# Altium schematic sheet Supply_Magneto.SchDoc: Power Supply
size 420 x 297 mm; EDA_Number: ARTIQ; Projet: HVPSU_ISOL; Author: G.Kasprowicz; CompanyName: WUT ISE; DrawnBy: G.Kasprowicz; Organization: WUT ISE; Address1: PW ISE; Address2: Nowowiejska 15/19 00-665 Warsaw; Address3: gkasprow@gmail.com; DocumentNumber: 4; Revision: 2; SheetNumber: 4; SheetTotal: 7; ModifiedBy: -; CheckedDate: -; DivGrp: WUT ISE; Designer: G.Kasprowicz; ModifiedDate: -; ProjectName: Sensor Box
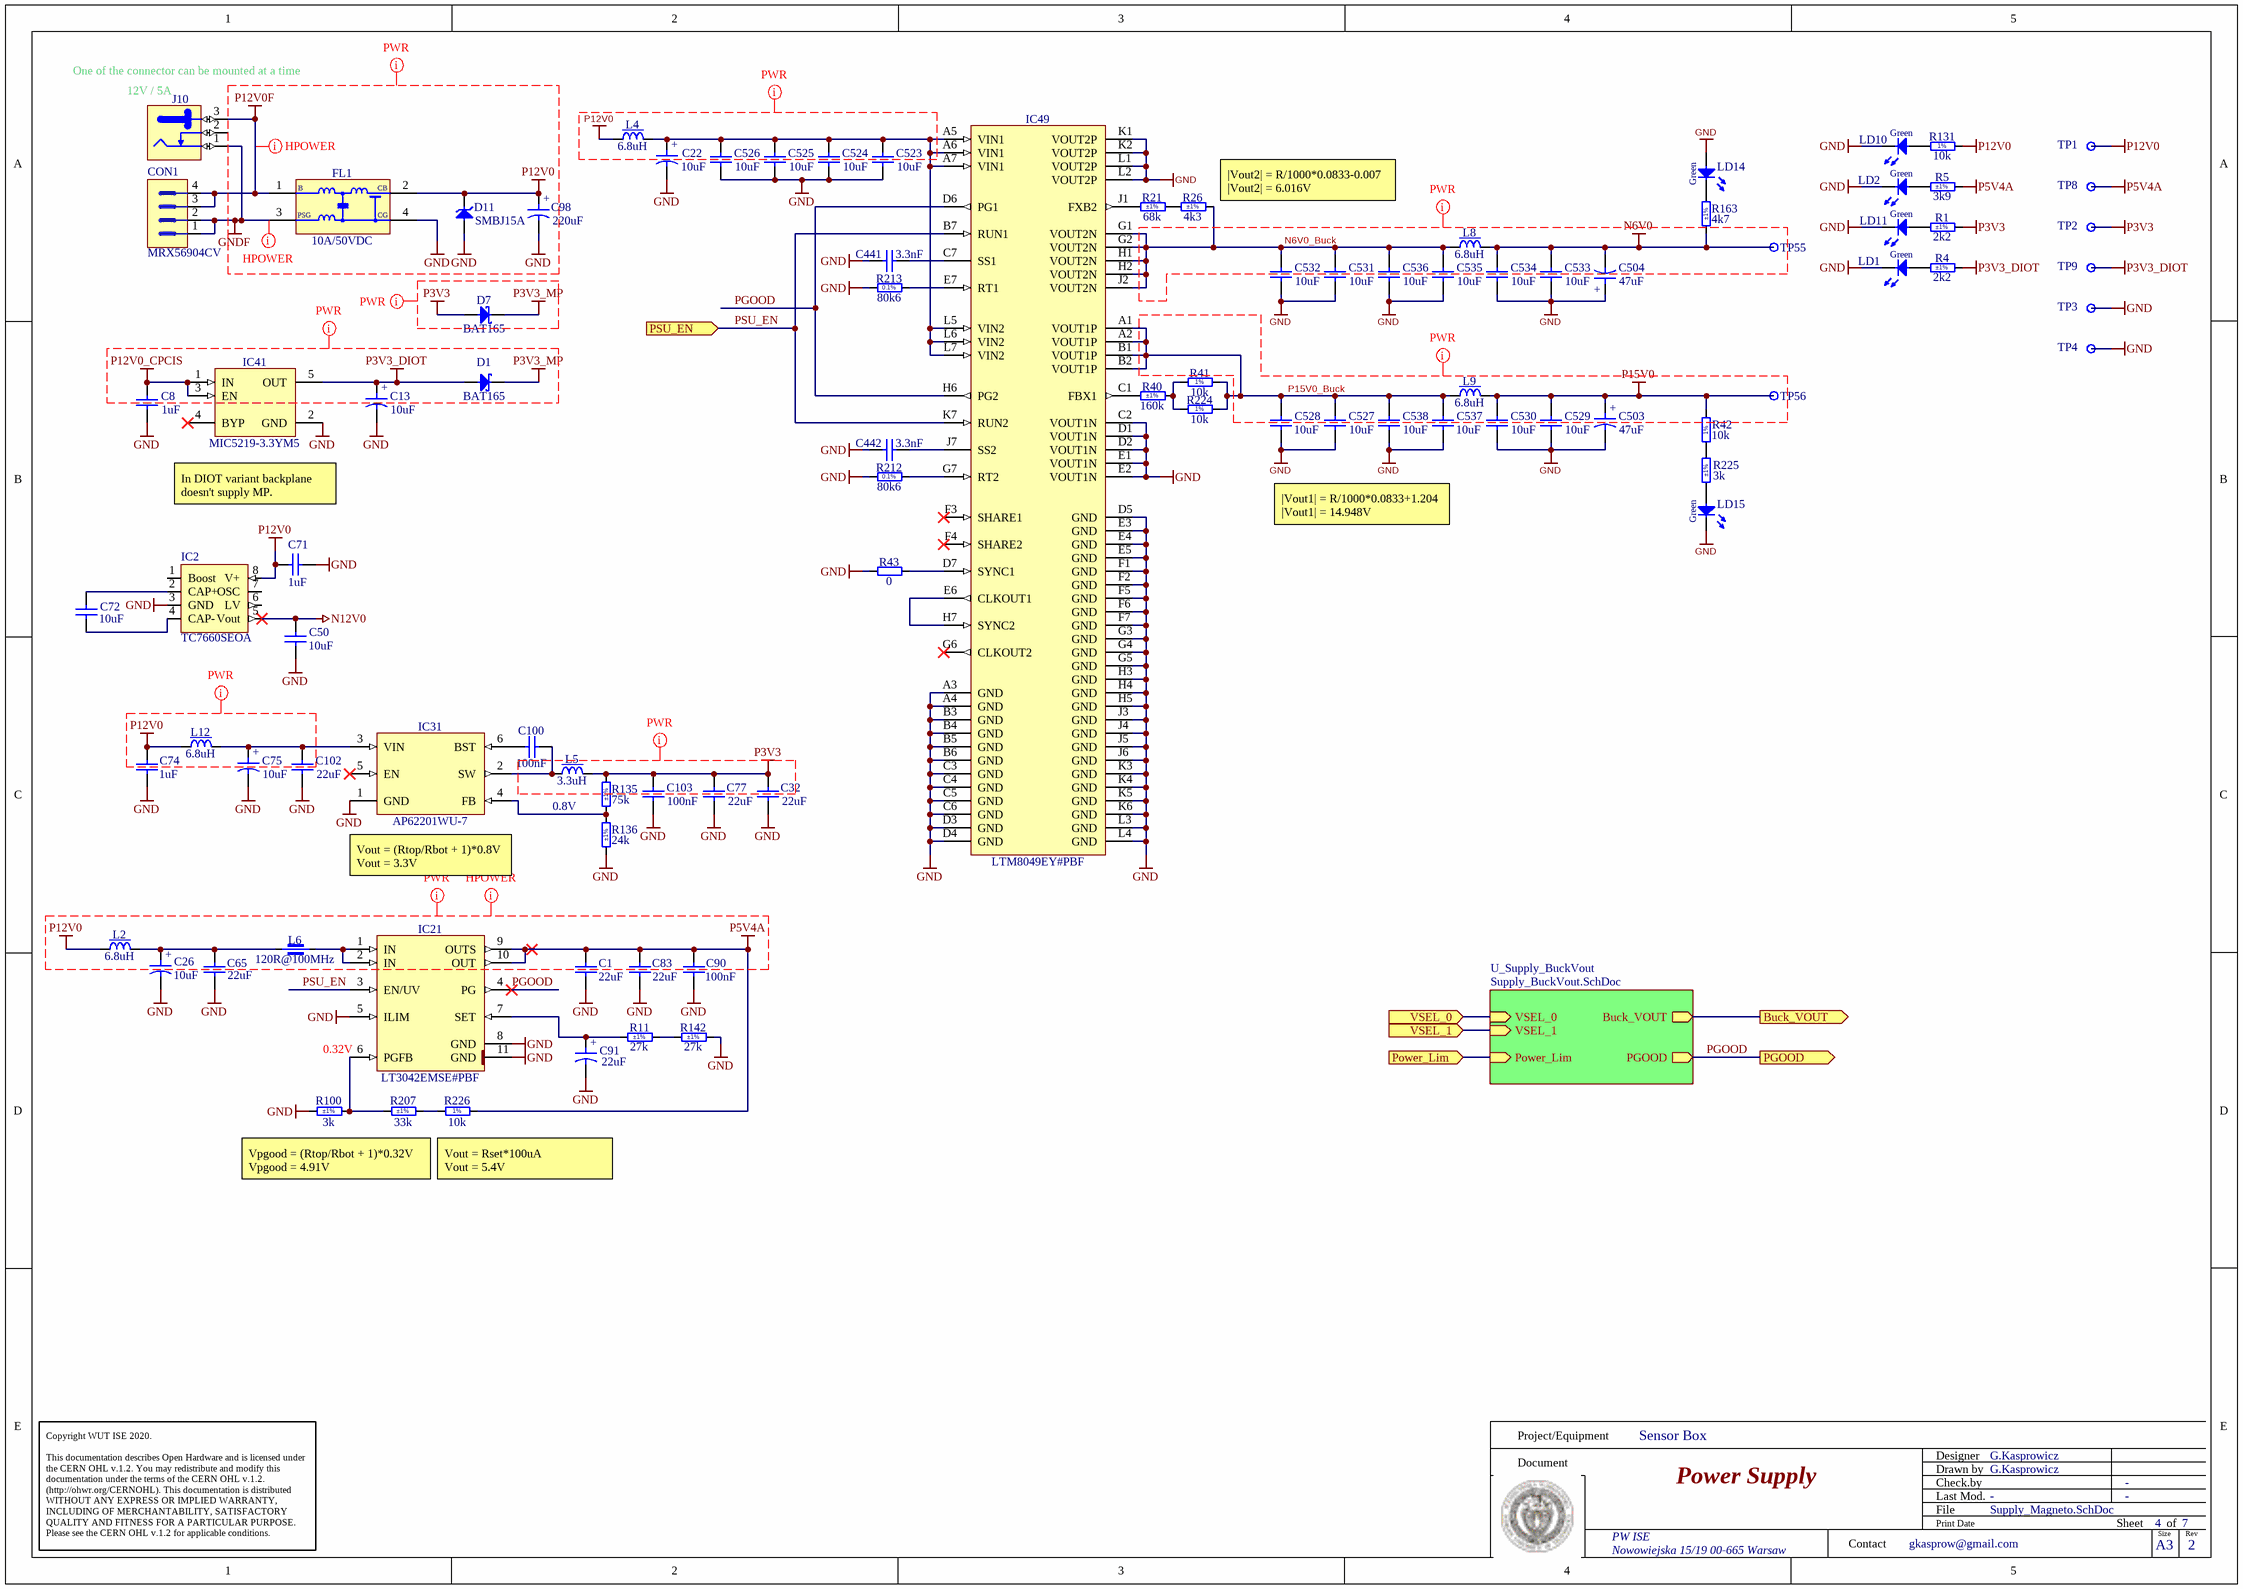
[diagram p0: Supply_Magneto.SchDoc]

## Parts
C1  22uF  [CAPC2012X135N]
C8  1uF  [CAPC1608X87N]
C13  10uF  [CAPMP3216X180N]
C22  10uF  [CAPMP3216X180N]
C26  10uF  [CAPMP3216X180N]
C32  22uF  [CAPC2012X135N]
C50  10uF  [CAPC1608X80N]
C65  22uF  [CAPC2012X135N]
C71  1uF  [CAPC1608X87N]
C72  10uF  [CAPC1608X80N]
C74  1uF  [CAPC1608X87N]
C75  10uF  [CAPMP3216X180N]
C77  22uF  [CAPC2012X135N]
C83  22uF  [CAPC2012X135N]
C90  100nF  [CAPC1005X55N]
C91  22uF  [CAPMP3528X210N]
C98  220uF  [CAPAE830X620N]
C100  100nF  [CAPC1005X55N]
C102  22uF  [CAPC2012X135N]
C103  100nF  [CAPC1005X55N]
C441  3.3nF  [CAPC1005X55N]
C442  3.3nF  [CAPC1005X55N]
C503  47uF  [CAPMP6032X280N]
C504  47uF  [CAPMP6032X280N]
C523  10uF  [CAPC2012X95N]
C524  10uF  [CAPC2012X95N]
C525  10uF  [CAPC2012X95N]
C526  10uF  [CAPC2012X95N]
C527  10uF  [CAPC2012X95N]
C528  10uF  [CAPC2012X95N]
C529  10uF  [CAPC2012X95N]
C530  10uF  [CAPC2012X95N]
C531  10uF  [CAPC2012X95N]
C532  10uF  [CAPC2012X95N]
C533  10uF  [CAPC2012X95N]
C534  10uF  [CAPC2012X95N]
C535  10uF  [CAPC2012X95N]
C536  10uF  [CAPC2012X95N]
C537  10uF  [CAPC2012X95N]
C538  10uF  [CAPC2012X95N]
CON1  MRX56904CV  [MRX56904CV]
D1  BAT165  [SOD2512X110N]
D7  BAT165  [SOD2512X110N]
D11  SMBJ15A  [DIOM5336X265N]
FL1  10A/50VDC  [FIL_MURATA_BNX02]
IC2  TC7660SEOA  [SO-8]
IC21  LT3042EMSE#PBF  [SOP50P490X110-11N-R168X198]
IC31  AP62201WU-7  [SOT95P280X100-6N]
IC41  MIC5219-3.3YM5  [SOT95P280X145-5N]
IC49  LTM8049EY#PBF  [BGA77C127P7X11_900X1500X262]
J10  Jack  [SWITCHCRAFT_L712RA]  (value not drawn)
L2  6.8uH  [IND_COILCRAFT_XAL4030]
L4  6.8uH  [IND_COILCRAFT_XAL4030]
L5  3.3uH  [IND_WURTH_WE-TPC_4828]
L6  120R@100MHz  [INDC1608X65N]
L8  6.8uH  [IND_COILCRAFT_XAL4030]
L9  6.8uH  [IND_COILCRAFT_XAL4030]
L12  6.8uH  [IND_COILCRAFT_XAL4030]
LD1  Green  [LED_KINGBRIGHT_KPH-1608CGCK]
LD2  Green  [LED_KINGBRIGHT_KPH-1608CGCK]
LD10  Green  [LED_KINGBRIGHT_KPH-1608CGCK]
LD11  Green  [LED_KINGBRIGHT_KPH-1608CGCK]
LD14  Green  [LED_KINGBRIGHT_KPH-1608CGCK]
LD15  Green  [LED_KINGBRIGHT_KPH-1608CGCK]
R1  2k2  Tolerance: ±1%  [RESC1608X55N]
R4  2k2  Tolerance: ±1%  [RESC1608X55N]
R5  3k9  Tolerance: ±1%  [RESC1005X40N]
R11  27k  Tolerance: ±1%  [RESC1608X55N]
R21  68k  Tolerance: ±1%  [RESC1608X55N]
R26  4k3  Tolerance: ±1%  [RESC1608X55N]
R40  160k  Tolerance: ±1%  [RESC1608X55N]
R41  10k  [RESC1005X40N]
R42  10k  [RESC1005X40N]
R43  0  [RESC1005X40N]
R100  3k  Tolerance: ±1%  [RESC1005X40N]
R131  10k  [RESC1005X40N]
R135  75k  Tolerance: ±1%  [RESC1608X55N]
R136  24k  Tolerance: ±1%  [RESC1608X55N]
R142  27k  Tolerance: ±1%  [RESC1608X55N]
R163  4k7  Tolerance: ±1%  [RESC1608X55N]
R207  33k  Tolerance: ±1%  [RESC1608X55N]
R212  80k6  [RESC1608X55N]
R213  80k6  [RESC1608X55N]
R224  10k  [RESC1005X40N]
R225  3k  Tolerance: ±1%  [RESC1005X40N]
R226  10k  [RESC1005X40N]
TP1  Test Point  [TPS127]  (value not drawn)  (no BOM)
TP2  Test Point  [TPS127]  (value not drawn)  (no BOM)
TP3  Test Point  [TPS127]  (value not drawn)  (no BOM)
TP4  Test Point  [TPS127]  (value not drawn)  (no BOM)
TP8  Test Point  [TPS127]  (value not drawn)  (no BOM)
TP9  Test Point  [TPS127]  (value not drawn)  (no BOM)
TP55  Test Point  [TPS127]  (value not drawn)  (no BOM)
TP56  Test Point  [TPS127]  (value not drawn)  (no BOM)

## Sub-sheets
U_Supply_BuckVout = Supply_BuckVout.SchDoc: PGOOD (out), VSEL_0 (in), VSEL_1 (in), Buck_VOUT (out), Power_Lim (in)

## Ports
Buck_VOUT (out), PGOOD (out), Power_Lim (in), PSU_EN (in), VSEL_0 (in), VSEL_1 (in)

## Nets
GND: C1.1 C8.1 C13.2 C22.2 C26.2 C32.1 C50.1 C65.1 C71.1 C74.1 C75.2 C77.1 C83.1 C90.1 C91.2 C98.2 C102.1 C103.1 C441.1 C442.1 C503.2 C504.1 C523.1 C524.1 C525.1 C526.1 C527.1 C528.1 C529.1 C530.1 C531.1 C532.1 C533.1 C534.1 C535.1 C536.1 C537.1 C538.1 D11.2(A) FL1.4(CG) IC2.3(GND) IC21.5(ILIM) IC21.8(GND) IC21.11(GND) IC31.1(GND) IC41.2(GND) IC49.A3(GND) IC49.A4(GND) IC49.B3(GND) IC49.B4(GND) IC49.B5(GND) IC49.B6(GND) IC49.C2(VOUT1N) IC49.C3(GND) IC49.C4(GND) IC49.C5(GND) IC49.C6(GND) IC49.D1(VOUT1N) IC49.D2(VOUT1N) IC49.D3(GND) IC49.D4(GND) IC49.D5(GND) IC49.E1(VOUT1N) IC49.E2(VOUT1N) IC49.E3(GND) IC49.E4(GND) IC49.E5(GND) IC49.F1(GND) IC49.F2(GND) IC49.F5(GND) IC49.F6(GND) IC49.F7(GND) IC49.G3(GND) IC49.G4(GND) IC49.G5(GND) IC49.H3(GND) IC49.H4(GND) IC49.H5(GND) IC49.J3(GND) IC49.J4(GND) IC49.J5(GND) IC49.J6(GND) IC49.K1(VOUT2P) IC49.K2(VOUT2P) IC49.K3(GND) IC49.K4(GND) IC49.K5(GND) IC49.K6(GND) IC49.L1(VOUT2P) IC49.L2(VOUT2P) IC49.L3(GND) IC49.L4(GND) LD1.1(C) LD2.1(C) LD10.1(C) LD11.1(C) LD14.2(A) LD15.1(C) R43.1 R100.1 R136.1 R142.2 R212.1 R213.1 TP3.1 TP4.1
GNDF: CON1.1 CON1.2 FL1.3(PSG) J10.1
N6V0: C504.2 C533.2 C534.2 L8.2 R163.1 TP55.1
N12V0: C50.2 IC2.5(Vout)
P3V3: C32.2 C77.2 C103.2 D7.2(A) L5.2 R1.2 R135.2 TP2.1
P3V3_DIOT: C13.1 D1.2(A) IC41.5(OUT) R4.2 TP9.1
P3V3_MP: D1.1(C) D7.1(C)
P5V4A: C1.2 C83.2 C90.2 IC21.9(OUTS) IC21.10(OUT) R5.2 R226.2 TP8.1
P12V0: C71.2 C74.2 C98.1 D11.1(C) FL1.2(CB) IC2.8(V+) L2.1 L4.1 L12.1 R131.2 TP1.1
P12V0_CPCIS: C8.2 IC41.1(IN) IC41.3(EN)
P12V0F: CON1.3 CON1.4 FL1.1(B) J10.3
P15V0: C503.1 C529.2 C530.2 L9.2 R42.2 TP56.1
Buck_VOUT: port Buck_VOUT, sheet U_Supply_BuckVout/Buck_VOUT
N6V0_Buck: C531.2 C532.2 C535.2 C536.2 IC49.G1(VOUT2N) IC49.G2(VOUT2N) IC49.H1(VOUT2N) IC49.H2(VOUT2N) IC49.J2(VOUT2N) L8.1 R26.2
P15V0_Buck: C527.2 C528.2 C537.2 C538.2 IC49.A1(VOUT1P) IC49.A2(VOUT1P) IC49.B1(VOUT1P) IC49.B2(VOUT1P) L9.1 R41.2 R224.2
PGOOD: IC21.4(PG) IC49.D6(PG1) IC49.H6(PG2) ; port PGOOD, sheet U_Supply_BuckVout/PGOOD
Power_Lim: port Power_Lim, sheet U_Supply_BuckVout/Power_Lim
PSU_EN: IC21.3(EN/UV) IC49.B7(RUN1) IC49.K7(RUN2) ; port PSU_EN
VSEL_0: port VSEL_0, sheet U_Supply_BuckVout/VSEL_0
VSEL_1: port VSEL_1, sheet U_Supply_BuckVout/VSEL_1
NetC22_1: C22.1 C523.2 C524.2 C525.2 C526.2 IC49.A5(VIN1) IC49.A6(VIN1) IC49.A7(VIN1) IC49.L5(VIN2) IC49.L6(VIN2) IC49.L7(VIN2) L4.2
NetC26_1: C26.1 C65.2 L2.2 L6.1
NetC72_1: C72.1 IC2.4(CAP-)
NetC72_2: C72.2 IC2.2(CAP+)
NetC75_1: C75.1 C102.2 IC31.3(VIN) L12.2
NetC91_1: C91.1 IC21.7(SET) R11.1
NetC100_1: C100.1 IC31.6(BST)
NetC100_2: C100.2 IC31.2(SW) L5.1
NetC441_2: C441.2 IC49.C7(SS1)
NetC442_2: C442.2 IC49.J7(SS2)
NetIC21_1: IC21.1(IN) IC21.2(IN) L6.2
NetIC21_6: IC21.6(PGFB) R100.2 R207.1
NetIC31_4: IC31.4(FB) R135.1 R136.2
NetIC49_C1: IC49.C1(FBX1) R40.1
NetIC49_D7: IC49.D7(SYNC1) R43.2
NetIC49_E6: IC49.E6(CLKOUT1) IC49.H7(SYNC2)
NetIC49_E7: IC49.E7(RT1) R213.2
NetIC49_G7: IC49.G7(RT2) R212.2
NetIC49_J1: IC49.J1(FXB2) R21.1
NetLD1_2: LD1.2(A) R4.1
NetLD2_2: LD2.2(A) R5.1
NetLD10_2: LD10.2(A) R131.1
NetLD11_2: LD11.2(A) R1.1
NetLD14_1: LD14.1(C) R163.2
NetLD15_2: LD15.2(A) R225.1
NetR11_2: R11.2 R142.1
NetR21_2: R21.2 R26.1
NetR40_2: R40.2 R41.1 R224.1
NetR42_1: R42.1 R225.2
NetR207_2: R207.2 R226.1

Not connected (* = marked no-connect by the designer): IC2 1(Boost) 6(LV) 7(OSC); IC31 5(EN)*; IC41 4(BYP)*; IC49 F3(SHARE1)* F4(SHARE2)* G6(CLKOUT2)*; J10 2

## Layout directives
net class Hpower; rule Routing Via Style [Pref Size = 0.7mm    Pref Hole Size = 0.5mm]; rule Width Constraint [Pref Width = 20mil    Min Width = 15mil    Max Width = 50mil]: GNDF, P12V0F
net class Hpower: P5V4A, P12V0
net class PWR: GND, GNDF, N6V0, N6V0_Buck, P3V3, P3V3_DIOT, P3V3_MP, P5V4A, P12V0, P12V0_CPCIS, P12V0F, P15V0, P15V0_Buck

## Notes on the sheet
- (near J10) One of the connector can be mounted at a time
- (near J10) 12V / 5A
- (near R26) |Vout2| = R/1000*0.0833-0.007
  |Vout2| = 6.016V
- In DIOT variant backplane doesn't supply MP.
- |Vout1| = R/1000*0.0833+1.204
  |Vout1| = 14.948V
- 0.8V
- (near IC31) Vout = (Rtop/Rbot + 1)*0.8V
  Vout = 3.3V
- (near IC21) 0.32V
- Vpgood = (Rtop/Rbot + 1)*0.32V
  Vpgood = 4.91V
- Vout = Rset*100uA
  Vout = 5.4V
- Project/Equipment
- Document
- Designer
- Drawn by
- Check.by
- Copyright WUT ISE 2020.
  This documentation describes Open Hardware and is licensed under the CERN OHL v.1.2. You may redistribute and modify this documentation under the terms of the CERN OHL v.1.2. (http://ohwr.org/CERNOHL). This documentation is distributed WITHOUT ANY EXPRESS OR IMPLIED WARRANTY, INCLUDING OF MERCHANTABILITY, SATISFACTORY QUALITY AND FITNESS FOR A PARTICULAR PURPOSE. Please see the CERN OHL v.1.2 for applicable conditions.
- Contact
- File
- Last Mod.
- Print Date
- Sheet
- Size
- A3
- of
- Rev
- (in symbol CAE830-620_220UF_16V_20%) +
- (in symbol CTE3216-18_10UF_16V_20%_AVX_TCJ) +
- (in symbol CTE3528-21_22UF_10V_10%_LESR0700) +
- (in symbol CTE6032-28_47UF_16V_10%_LESR0350) +
- (in symbol R0402_10K_1%_0.0625W_100PPM) 1%
- (in symbol R0603_80K6_0.1%_0.063W_10PPM) 0.1%

## Library data of the parts
C1 C32 C65 C77 C83 C102 = CC0805_22UF_16V_10%_X5R: Non-polarised capacitor; Part Description: SMD Multilayer Chip Ceramic Capacitor; Manufacturer: GENERIC; Manufacturer1 Part Number: C2012X5R1C226KT; Voltage: 16V; TC: X5R; Tolerance: ±10%; Part Number: CC0805_22UF_16V_10%_X5R; Component Kind: Standard; Component Type: Standard; Pin Count: 2; Value: 22uF; Status: Preferred; Manufacturer Part Number: CC0805_22UF_16V_10%_X5R; Case: 0805; Mounted: Yes; Socket: No; SMD: Yes; Sense: No; Manufacturer1 Example: TDK; Manufacturer1 ComponentHeight: 1.35mm; HelpURL: \\cern.ch\dfs\Applications\Altium\Datasheets\CC0805_X5R_TDK_C.pdf; Author: CERN DEM JLC; CreateDate: 25.10.2012; LatestRevisionDate: 25.10.2012
C8 C71 C74 = CC0603_1UF_25V_10%_X7R: Non-polarised capacitor; Part Description: SMD Multilayer Chip Ceramic Capacitor; Manufacturer: GENERIC; Manufacturer1 Part Number: GCM188R71E105KA64D; Voltage: 25V; TC: X7R; Tolerance: ±10%; Part Number: CC0603_1UF_25V_10%_X7R; Component Kind: Standard; Component Type: Standard; Pin Count: 2; Value: 1uF; Status: None; Manufacturer Part Number: CC0603_1UF_25V_10%_X7R; Case: 0603; Mounted: Yes; Socket: No; SMD: Yes; Sense: No; Manufacturer1 Example: MURATA; Manufacturer1 ComponentHeight: 0.9mm; HelpURL: \\cern.ch\dfs\Applications\Altium\Datasheets\CC0603_X7R_MURATA.pdf; Author: CERN DEM JLC; CreateDate: 18.01.2011; LatestRevisionDate: 18.01.2011
C13 C22 C26 C75 = CTE3216-18_10UF_16V_20%_AVX_TCJ: Polarised capacitor; Part Description: ESR 0R200 Tantalum Solid Electrolytic Chip Capacitor with Conductive Polymer Electrode; Manufacturer: AVX; Manufacturer Part Number: TCJA106M016R0200 or  or TR3A106K016C1700; Manufacturer1 Part Number: TCJA106M016R0200; Voltage: 16V; Tolerance: ±20%; Part Number: CTE3216-18_10UF_16V_20%_AVX_TCJ; Component Kind: Standard; Component Type: Standard; Pin Count: 2; Value: 10uF; Status: Preferred; Case: A; Mounted: Yes; Socket: No; SMD: Yes; Sense: No; ComponentHeight: 1.8mm; HelpURL: \\cern.ch\dfs\Applications\Altium\Datasheets\CTE_AVX_TCJ.pdf; Author: CERN DEM JLC; CreateDate: 29.03.2012; LatestRevisionDate: 29.03.2012
C50 C72 = CC0603_10UF_16V_20%_X5R: Non-polarised capacitor; Part Description: SMD Multilayer Chip Ceramic Capacitor; Manufacturer: GENERIC; Manufacturer1 Part Number: GRM188R61C106MA73D; Voltage: 16V; TC: X5R; Tolerance: ±20%; Part Number: CC0603_10UF_16V_20%_X5R; Component Kind: Standard; Component Type: Standard; Pin Count: 2; Value: 10uF; Status: None; Manufacturer Part Number: CC0603_10UF_16V_20%_X5R; Case: 0603; Mounted: Yes; Socket: No; SMD: Yes; Sense: No; Manufacturer1 Example: MURATA; Manufacturer1 ComponentHeight: 0.8mm; HelpURL: \\cern.ch\dfs\Applications\Altium\Datasheets\CC0603_X5R_MURATA_GRM.pdf; Author: CERN DEM MR; CreateDate: 02.03.2016; LatestRevisionDate: 02.03.2016
C90 C100 C103 = CC0402_100NF_16V_10%_X5R: Non-polarised capacitor; Part Description: SMD Multilayer Chip Ceramic Capacitor; Manufacturer: GENERIC; Manufacturer1 Part Number: GRM155R61C104KA88D; Voltage: 16V; TC: X5R; Tolerance: ±10%; Part Number: CC0402_100NF_16V_10%_X5R; Component Kind: Standard; Component Type: Standard; Pin Count: 2; Value: 100nF; Status: None; Manufacturer Part Number: CC0402_100NF_16V_10%_X5R; Case: 0402; Mounted: Yes; Socket: No; SMD: Yes; Sense: No; Manufacturer1 Example: MURATA; Manufacturer1 ComponentHeight: 0.55mm; HelpURL: \\cern.ch\dfs\Applications\Altium\Datasheets\CC0402_X5R_MURATA_GRM.pdf; Author: CERN DEM JLC; CreateDate: 10.12.2013; LatestRevisionDate: 10.12.2013
C91 = CTE3528-21_22UF_10V_10%_LESR0700: Polarised capacitor; Part Description: Low ESR 0R7 Solid Tantalum Chip Capacitor; Manufacturer: GENERIC; Manufacturer1 Part Number: TPSB226K010R0700; Voltage: 10V; Tolerance: ±10%; Part Number: CTE3528-21_22UF_10V_10%_LESR0700; Component Kind: Standard; Component Type: Standard; Pin Count: 2; Value: 22uF; Status: Preferred; Manufacturer Part Number: CTE3528-21_22UF_10V_10%_LESR0700; Case: B; Mounted: Yes; Socket: No; SMD: Yes; Sense: No; Manufacturer1 Example: AVX; Manufacturer1 ComponentHeight: 2.1mm; HelpURL: \\cern.ch\dfs\Applications\Altium\Datasheets\CTE-LESR_AVX_TPS.pdf; Author: CERN DEM JLC; CreateDate: 05.05.2008; LatestRevisionDate: 20.01.2009
C98 = CAE830-620_220UF_16V_20%: Polarised capacitor; Part Description: Aluminum Electrolytic SMT Capacitor; Manufacturer: PANASONIC; Manufacturer Part Number: EEEFK1C221AP; Voltage: 16V; Tolerance: ±20%; Part Number: CAE830-620_220UF_16V_20%; Component Kind: Standard; Component Type: Standard; Pin Count: 2; Value: 220uF; Status: Not Recommended; Case: E; Mounted: Yes; Socket: No; SMD: Yes; Sense: No; ComponentHeight: 6.2mm; HelpURL: \\cern.ch\dfs\Applications\Altium\Datasheets\CAE_PANASONIC_FK.pdf; Author: CERN DEM JLC; CreateDate: 03.12.2007; LatestRevisionDate: 05.11.2014; Manufacturer1 Part Number: EEEFK1C221AP
C441 C442 = CC0402_3.3NF_50V_10%_X7R: Non-polarised capacitor; Manufacturer: GENERIC; Manufacturer1 Part Number: GRM155R71H332KA01D; Part Description: SMD Multilayer Chip Ceramic Capacitor; TC: X7R; Tolerance: ±10%; Voltage: 50V; Case: 0402; Manufacturer Part Number: CC0402_3.3NF_50V_10%_X7R; Manufacturer1 Example: Murata; Part Number: CC0402_3.3NF_50V_10%_X7R; Pin Count: 2; SMD: Yes; Status: Not Recommended; Value: 3.3nF; Component Kind: Standard; Component Type: Standard; Mounted: Yes; Socket: No; Sense: No; Manufacturer1 ComponentHeight: 0.55mm; HelpURL: \\cern.ch\dfs\Applications\Altium\Datasheets\CC0402_X7R_PHYCOMP.pdf; Author: CERN DEM JLC; CreateDate: 03.12.2007; LatestRevisionDate: 03.12.2007
C503 C504 = CTE6032-28_47UF_16V_10%_LESR0350: Polarised capacitor; Manufacturer: GENERIC; Manufacturer1 Part Number: TPSC476K016R0350; Part Description: Low ESR 0R350 Solid Tantalum Chip Capacitor; Tolerance: ±10%; Voltage: 16V; Case: C; Manufacturer Part Number: CTE6032-28_47UF_16V_10%_LESR0350; Manufacturer1 Example: AVX; Part Number: CTE6032-28_47UF_16V_10%_LESR0350; Pin Count: 2; SMD: Yes; Value: 47uF; Component Kind: Standard; Component Type: Standard; Status: Preferred; Mounted: Yes; Socket: No; Sense: No; Manufacturer1 ComponentHeight: 2.8mm; HelpURL: \\cern.ch\dfs\Applications\Altium\Datasheets\CTE-LESR_AVX_TPS.pdf; Author: CERN DEM JLC; CreateDate: 05.05.2008; LatestRevisionDate: 20.01.2009
C523-C538 = CC0805_10UF_25V_10%_X5R: Non-polarised capacitor; Manufacturer: GENERIC; Manufacturer1 Part Number: GRM21BR61E106KA73L; Part Description: SMD Multilayer Chip Ceramic Capacitor; TC: X5R; Tolerance: ±10%; Voltage: 25V; Case: 0805; Manufacturer Part Number: CC0805_10UF_25V_10%_X5R; Manufacturer1 Example: MURATA; Part Number: CC0805_10UF_25V_10%_X5R; Pin Count: 2; SMD: Yes; Status: Preferred; Value: 10uF; Component Kind: Standard; Component Type: Standard; Mounted: Yes; Socket: No; Sense: No; Manufacturer1 ComponentHeight: 0.95mm; HelpURL: \\cern.ch\dfs\Applications\Altium\Datasheets\CC0805_X5R_MURATA_GRM.pdf; Author: CERN DEM JLC; CreateDate: 25.10.2012; LatestRevisionDate: 06.09.2016
CON1 = CON_CRIMP_4.2mm_RA_4: 4.2mm cripm terminal header; Manufacturer1 Part Number: 64900429522; Manufacturer1: Wurth; Part Number: MRX56904CV
D1 = BAT165: Schottky Diode; Manufacturer: INFINEON; Part Description: Medium Power AF Schottky Diode; Manufacturer1 Part Number: BAT 165 E6327; Voltage: 40V; Power: 750mA; PressFit: No; Bonding: No; Manufacturer Part Number: BAT165; PackageDescription: Small Outline Diode (SOD-323), 1.70mm W X 1.25mm L X 1.10mm H body,  IPC Medium Density; Part Number: BAT165; Component Kind: Standard; Component Type: Standard; Device: BAT165; Pin Count: 2; Case: SOD323; Mounted: Yes; Socket: No; SMD: Yes; Sense: No; ComponentHeight: 1.1mm; HelpURL: \\cern.ch\dfs\Applications\Altium\Datasheets\BAT165.pdf; Author: CERN DEM JLC; CreateDate: 12.11.2014; LatestRevisionDate: 12.11.2014
D7 = BAT165: Schottky Diode; Part Description: Medium Power AF Schottky Diode; Manufacturer: INFINEON; Manufacturer1 Part Number: BAT 165 E6327; Voltage: 40V; Power: 750mA; PressFit: No; Bonding: No; Part Number: BAT165; Component Kind: Standard; Component Type: Standard; Device: BAT165; PackageDescription: Small Outline Diode (SOD-323), 1.70mm W X 1.25mm L X 1.10mm H body,  IPC Medium Density; Manufacturer Part Number: BAT165; Pin Count: 2; Case: SOD-323; Mounted: Yes; Socket: No; SMD: Yes; Sense: No; ComponentHeight: 1.1mm; HelpURL: \\cern.ch\dfs\Applications\Altium\Datasheets\BAT165.pdf; Author: CERN DEM JLC; CreateDate: 12.11.2014; LatestRevisionDate: 12.11.2014
D11 = SMBJ15A: Zener Diode; Part Description: Uni-Directional Transient Voltage Suppressor Diode; Manufacturer1: FAIRCHILD SEMICONDUCTOR; Voltage: 15V; Power: 600W; PressFit: No; Bonding: No; Part Number: SMBJ15A; Component Kind: Standard; Component Type: Standard; Device: SMBJ15A; PackageDescription: DO-214-AA/SMB Diode, Molded Body; 5.34mm L X 3.625mm W X 2.65mm H, IPC Medium Density; Manufacturer1 Part Number: SMBJ15A; Pin Count: 2; Case: DO-214AA; Mounted: Yes; Socket: No; SMD: Yes; Sense: No; ComponentHeight: 2.65mm; HelpURL: \\cern.ch\dfs\Applications\Altium\Datasheets\SMBJ.pdf; Author: CERN DEM JLC; CreateDate: 08.12.2008; LatestRevisionDate: 19.12.2011
FL1 = FIL_MURATA_BNX022-01L: Block Type EMIFIL (LC Combined); Part Description: Block Type EMIFIL (LC Combined) SMD Type, BNX02* Series; Manufacturer1: MURATA; Resistance: 0.5R; Part Number: FIL_MURATA_BNX022-01L; Component Kind: Standard; Component Type: Standard; Pin Count: 2; Value: 10A/50VDC; Status: None; Manufacturer1 Part Number: BNX022-01L; Mounted: Yes; Socket: No; SMD: Yes; Sense: No; ComponentHeight: 3.3mm; HelpURL: \\cern.ch\dfs\Applications\Altium\Datasheets\FIL_MURATA_BNX022-01L.pdf; Author: CERN DEM JLC; CreateDate: 10.10.2012; LatestRevisionDate: 10.10.2012
IC2 = PM_TC7660: 20mA PUMP DC-TO-DC VOLTAGE CONVERTER; Manufacturer1: Microchip; Part Number: TC7660SEOA; Manufacturer1 Part Number: TC7660SEOA
IC21 = LT3042EMSE#PBF: 20V, 200mA, Ultralow Noise, Ultrahigh PSRR RF Linear Regulator; Manufacturer1: LINEAR TECHNOLOGY; PressFit: No; Bonding: No; Part Number: LT3042EMSE#PBF; Component Kind: Standard; Component Type: Standard; Device: LT3042EMSE#PBF; PackageDescription: SOP, 0.50mm, Pitch; 10 pin, 3.00mm W X 3.00mm L X 1.10mm H body (w/thermal tab  1.68 X 1.98 mm), IPC Medium Density; Part Description: 20V, 200mA, Ultralow Noise, Ultrahigh PSRR RF Linear Regulator; Manufacturer1 Part Number: LT3042EMSE#PBF; Pin Count: 11; Case: MSOP10; Mounted: Yes; Socket: No; SMD: Yes; Sense: No; ComponentHeight: 1.1mm; HelpURL: \\cern.ch\dfs\Applications\Altium\Datasheets\LT3042EMSE#PBF.pdf; Author: CERN DEM MR; CreateDate: 09.06.2016; LatestRevisionDate: 09.06.2016
IC31 = AP62201WU-7: 4.2V TO 18V INPUT, 2A LOW IQ SYNCHRONOUS BUCK CONVERTER; Manufacturer1: DIODES INCORPORATED; PressFit: No; Bonding: No; Part Number: AP62201WU-7; Component Kind: Standard; Component Type: Standard; Device: AP62201WU-7; PackageDescription: SOT23, 0.95mm Pitch; 6 Pin, 1.625mm W X 2.90mm L X 1.00mm H body, IPC Medium Density; Part Description: 4.2V TO 18V INPUT, 2A LOW IQ SYNCHRONOUS BUCK CONVERTER; Manufacturer1 Part Number: AP62201WU-7; Pin Count: 6; Case: SOT23-6; Mounted: Yes; Socket: No; SMD: Yes; Sense: No; ComponentHeight: 1.1mm; HelpURL: \\cern.ch\dfs\Applications\Altium\Datasheets\AP6220x.pdf; Author: CERN DEM HF; CreateDate: 07.01.2022; LatestRevisionDate: 07.01.2022
IC41 = MIC5219-3.3YM5: 500mA Peak Output LDO Regulator; Part Description: 3.3V 500mA Peak Output Low Drop-Out  (LDO) Regulator; Manufacturer1: MICROCHIP TECHNOLOGY; Manufacturer1 Part Number: MIC5219-3.3YM5-TR; PressFit: No; Bonding: No; Part Number: MIC5219-3.3YM5; Component Kind: Standard; Component Type: Standard; Device: MIC5219-3.3YM5; PackageDescription: SOT, 0.95mm pitch; 5 pin, 1.60mm W X 2.90mm L X 1.45mm H body, IPC Medium Density; Pin Count: 5; Case: SOT23-5; Mounted: Yes; Socket: No; SMD: Yes; Sense: No; ComponentHeight: 1.45mm; HelpURL: \\cern.ch\dfs\Applications\Altium\Datasheets\MIC5219-3.3YM5.pdf; Author: CERN DEM WB; CreateDate: 2019-04-16; LatestRevisionDate: 2019-04-16
IC49 = LTM8049EY#PBF: Dual SEPIC or Inverting uModule DC/DC Converter; Manufacturer1: LINEAR TECHNOLOGY; PressFit: No; Bonding: No; Part Number: LTM8049EY#PBF; Component Kind: Standard; Component Type: Standard; Device: LTM8049EY#PBF; PackageDescription: BGA, 1.27mm Pitch, Rect.; 77 Pin, 7 Columns X 11 Rows, 9.00mm X 15.00mm X 2.62mm H; Part Description: Dual SEPIC or Inverting uModule DC/DC Converter; Manufacturer1 Part Number: LTM8049EY#PBF; Pin Count: 77; Case: BGA77; Mounted: Yes; Socket: No; SMD: Yes; Sense: No; ComponentHeight: 2.62mm; HelpURL: \\cern.ch\dfs\Applications\Altium\Datasheets\LTM8049EY#PBF.pdf; Author: CERN DEM JLC; CreateDate: 08.12.2016; LatestRevisionDate: 08.12.2016
J10 = CON_DC_5A_THT_RA: 24V /3. 5A, 2.1mm Diameter Pin, SMD DC Power Supply Connector With  Break Contact; Part Description: 12V/5A, 2.5mm Diameter Pin, THT DC Power Supply Connector With  Break Contact; Manufacturer: SWITCHCRAFT; Manufacturer Part Number: L712RA; PressFit: No; Part Number: SWITCHCRAFT_L712RA; Component Kind: Standard; Component Type: Standard; Pin Count: 3; Family: Jack; Mounted: Yes; Socket: No; SMD: No; Sense: No; Status: None; ComponentHeight: 11mm; HelpURL: \\cern.ch\dfs\Applications\Altium\Datasheets\LUMBERG_161314.pdf; Author: GK; CreateDate: 15.02.2011; LatestRevisionDate: 20.07.2011
L2 L4 L8 L9 L12 = IND_6.8UH_20%_COILCRAFT_XAL4030: Inductor With Core; Part Description: SMD Shielded Power Inductor; Manufacturer1 Part Number: XAL4030-682MEC; Power: 3A; Resistance: 0.0741R; Tolerance: ±20%; Part Number: IND_6.8UH_20%_COILCRAFT_XAL4030; Component Kind: Standard; Component Type: Standard; Pin Count: 2; Value: 6.8uH; Status: None; Manufacturer1: COILCRAFT; Mounted: Yes; Socket: No; SMD: Yes; Sense: No; ComponentHeight: 2.1mm; HelpURL: \\cern.ch\dfs\Applications\Altium\Datasheets\IND_COILCRAFT_XAL4030.pdf; Author: CERN DEM MR; CreateDate: 14.03.2016; LatestRevisionDate: 14.03.2016
L5 = IND_3.3UH_30%_WURTH_WE-TPC_744043003: Inductor With Core; Part Description: Shielded Tiny Power Inductor (WE-TPC Serie); Manufacturer1: WURTH ELEKTRONIK; Power: 2.15A; Resistance: 0.03R; Tolerance: ±30%; Part Number: IND_3.3UH_30%_WURTH_WE-TPC_744043003; Component Kind: Standard; Component Type: Standard; Pin Count: 2; Value: 3.3uH; Manufacturer1 Part Number: 744043003; Mounted: Yes; Socket: No; SMD: Yes; Sense: No; ComponentHeight: 3mm; HelpURL: \\cern.ch\dfs\Applications\Altium\Datasheets\IND_WURTH_WE-TPC_744043003.pdf; Author: CERN DEM JLC; CreateDate: 12.07.2011; LatestRevisionDate: 24.01.2012
L6 = IND0603_MURATA_BLM18SG121TN1D: Part Description: SMD EMIFIL Suppression Chip Ferrite Bead; Manufacturer1: MURATA; Power: 3A; Resistance: 0.025R; Tolerance: ±25%; Part Number: IND0603_MURATA_BLM18SG121TN1D; Component Kind: Standard; Component Type: Standard; Pin Count: 2; Value: 120R@100MHz; Manufacturer1 Part Number: BLM18SG121TN1D; Case: 0603; Mounted: Yes; Socket: No; SMD: Yes; Sense: No; ComponentHeight: 0.65mm; HelpURL: \\cern.ch\dfs\Applications\Altium\Datasheets\IND0603_MURATA_BLM18S.pdf; Author: CERN DEM JLC; CreateDate: 23.07.2014; LatestRevisionDate: 25.10.2018
LD1 LD2 LD10 LD11 = LED_KINGBRIGHT_KPH-1608CGCK: LED Green 1C 2A; Part Description: SMD Green LED, Case 1.6mmX0.8mm(0603), 0.65mm Thickness; PressFit: No; Bonding: No; Part Number: LED_KINGBRIGHT_KPH-1608CGCK; Component Kind: Standard; Component Type: Standard; Color: Green; PackageDescription: SMT Green LED, Case 0603, Body L 1.6 x W 0.8mm H 0.65mm; Manufacturer1: KINGBRIGHT; Manufacturer1 Part Number: KPH-1608CGCK; Pin Count: 2; Mounted: Yes; Socket: No; SMD: Yes; Sense: No; ComponentHeight: 0.65mm; HelpURL: \\cern.ch\dfs\Applications\Altium\Datasheets\LED_KINGBRIGHT_KPH-1608CGCK.pdf; Author: CERN DEM JLC; CreateDate: 03/07/2017; LatestRevisionDate: 03/07/2017
LD14 LD15 = LED_KINGBRIGHT_KPH-1608CGCK: LED Green 1C 2A; Part Description: SMD Green LED, Case 1.6mmX0.8mm(0603), 0.65mm Thickness; Bonding: No; PressFit: No; Author: CERN DEM JLC; Color: Green; Component Kind: Standard; Component Type: Standard; ComponentHeight: 0.65mm; CreateDate: 03.07.2017; HelpURL: \\cern.ch\dfs\Applications\Altium\Datasheets\LED_KINGBRIGHT_KPH-1608CGCK.pdf; LatestRevisionDate: 03.07.2017; Manufacturer1 Part Number: KPH-1608CGCK; Manufacturer1: KINGBRIGHT; Mounted: Yes; PackageDescription: SMT Green LED, Case 0603, Body L 1.6 x W 0.8mm H 0.65mm; Part Number: LED_KINGBRIGHT_KPH-1608CGCK; Pin Count: 2; Sense: No; SMD: Yes; Socket: No
R1 R4 = R0603_2K2_1%_0.1W_100PPM: Resistor - 1%; Part Description: General Purpose Thick Film Chip Resistor; Manufacturer: GENERIC; Manufacturer Part Number: CRCW06032K20FKEA; Manufacturer1: Vishay; Power: 0.1W; TC: ±100ppm/°C; PressFit: No; Part Number: R0603_2K2_1%_0.1W_100PPM; Component Kind: Standard; Component Type: Standard; Pin Count: 2; Value: 2k2; Status: Preferred; Case: 0603; Mounted: Yes; Sense: No; Socket: No; SMD: Yes; Manufacturer1 Part Number: CRCW06032K20FKEA; Manufacturer1 ComponentHeight: 0.55mm; HelpURL: \\cern.ch\dfs\Applications\Altium\Datasheets\R0603_NIC_NRC.pdf; Author: CERN DEM JLC; CreateDate: 03.12.2007; LatestRevisionDate: 13.03.2008
R5 = R0402_3K9_1%_0.0625W_100PPM: Resistor - 1%; Part Description: General Purpose Thick Film Chip Resistor; Manufacturer: GENERIC; Manufacturer1: Vishay; Manufacturer1 Part Number: CRCW04023K90FKED; TC: ±100ppm/°C; PressFit: No; Part Number: R0402_3K9_1%_0.0625W_100PPM; Component Kind: Standard; Component Type: Standard; Pin Count: 2; Value: 3k9; Status: Not Recommended; Power: 0.0625W; Manufacturer Part Number: R0402_3K9_1%_0.0625W_100PPM; Case: 0402; Mounted: Yes; Sense: No; Socket: No; SMD: Yes; Manufacturer1 ComponentHeight: 0.4mm; HelpURL: \\cern.ch\dfs\Applications\Altium\Datasheets\R0402_Phycomp_RC0402.pdf; Author: CERN DEM JLC; CreateDate: 03.12.2007; LatestRevisionDate: 17.10.2012
R11 R142 = R0603_27K_1%_0.1W_100PPM: Resistor - 1%; Part Description: General Purpose Thick Film Chip Resistor; Manufacturer: GENERIC; Manufacturer1: Vishay; Manufacturer1 Part Number: CRCW060327K0FKEA; Power: 0.1W; TC: ±100ppm/°C; PressFit: No; Part Number: R0603_27K_1%_0.1W_100PPM; Component Kind: Standard; Component Type: Standard; Pin Count: 2; Value: 27k; Status: Preferred; Manufacturer Part Number: R0603_27K_1%_0.1W_100PPM; Case: 0603; Mounted: Yes; Sense: No; Socket: No; SMD: Yes; Manufacturer1 ComponentHeight: 0.55mm; HelpURL: \\cern.ch\dfs\Applications\Altium\Datasheets\R0603_NIC_NRC.pdf; Author: CERN DEM JLC; CreateDate: 03.12.2007; LatestRevisionDate: 13.03.2008
R21 = R0603_68K_1%_0.1W_100PPM: Resistor - 1%; Part Description: General Purpose Thick Film Chip Resistor; Manufacturer: GENERIC; Manufacturer1: Vishay; Manufacturer1 Part Number: CRCW060368K0FKEAC; Power: 0.1W; TC: ±100ppm/°C; PressFit: No; Part Number: R0603_68K_1%_0.1W_100PPM; Component Kind: Standard; Component Type: Standard; Pin Count: 2; Value: 68k; Status: Preferred; Manufacturer Part Number: R0603_68K_1%_0.1W_100PPM; Case: 0603; Mounted: Yes; Sense: No; Socket: No; SMD: Yes; Manufacturer1 ComponentHeight: 0.55mm; HelpURL: \\cern.ch\dfs\Applications\Altium\Datasheets\R0603_NIC_NRC.pdf; Author: CERN DEM JLC; CreateDate: 03.12.2007; LatestRevisionDate: 13.03.2008
R26 = R0603_4K3_1%_0.1W_100PPM: Resistor - 1%; Part Description: General Purpose Thick Film Chip Resistor; Manufacturer: GENERIC; Manufacturer1: Vishay; Manufacturer1 Part Number: CRCW06034K30FKEA; Power: 0.1W; TC: ±100ppm/°C; PressFit: No; Part Number: R0603_4K3_1%_0.1W_100PPM; Component Kind: Standard; Component Type: Standard; Pin Count: 2; Value: 4k3; Status: Preferred; Manufacturer Part Number: R0603_4K3_1%_0.1W_100PPM; Case: 0603; Mounted: Yes; Sense: No; Socket: No; SMD: Yes; Manufacturer1 ComponentHeight: 0.55mm; HelpURL: \\cern.ch\dfs\Applications\Altium\Datasheets\R0603_NIC_NRC.pdf; Author: CERN DEM JLC; CreateDate: 03.12.2007; LatestRevisionDate: 13.03.2008
R40 = R0603_160K_1%_0.1W_100PPM: Resistor - 1%; Part Description: General Purpose Thick Film Chip Resistor; Manufacturer: GENERIC; Manufacturer1: Vishay; Manufacturer1 Part Number: CRCW0603160KFKEA; Power: 0.1W; TC: ±100ppm/°C; PressFit: No; Part Number: R0603_160K_1%_0.1W_100PPM; Component Kind: Standard; Component Type: Standard; Pin Count: 2; Value: 160k; Status: Preferred; Manufacturer Part Number: R0603_160K_1%_0.1W_100PPM; Case: 0603; Mounted: Yes; Sense: No; Socket: No; SMD: Yes; Manufacturer1 ComponentHeight: 0.55mm; HelpURL: \\cern.ch\dfs\Applications\Altium\Datasheets\R0603_NIC_NRC.pdf; Author: CERN DEM JLC; CreateDate: 03.12.2007; LatestRevisionDate: 13.03.2008
R41 R42 R131 R224 = R0402_10K_1%_0.0625W_100PPM: Resistor - 1%; Part Description: General Purpose Thick Film Chip Resistor; Manufacturer: GENERIC; Manufacturer1: Vishay; Manufacturer1 Part Number: RCA040210K0FKED; TC: ±100ppm/°C; PressFit: No; Part Number: R0402_10K_1%_0.0625W_100PPM; Component Kind: Standard; Component Type: Standard; Pin Count: 2; Value: 10k; Status: Not Recommended; Power: 0.0625W; Tolerance: ±1%; Manufacturer Part Number: R0402_10K_1%_0.0625W_100PPM; Case: 0402; Mounted: Yes; Sense: No; Socket: No; SMD: Yes; Manufacturer1 ComponentHeight: 0.4mm; HelpURL: \\cern.ch\dfs\Applications\Altium\Datasheets\R0402_Phycomp_RC0402.pdf; Author: CERN DEM JLC; CreateDate: 03.12.2007; LatestRevisionDate: 17.10.2012
R43 = R0402_0R_JUMPER: Resistor; Manufacturer: GENERIC; Manufacturer1: Vishay; Manufacturer1 Part Number: CRCW04020000Z0EDC; Part Description: 1A (0.05R Max DC Resistance) Zero Ohm Jumper; PressFit: No; Case: 0402; Manufacturer Part Number: R0402_0R_JUMPER; Manufacturer1 ComponentHeight: 0.4mm; Part Number: R0402_0R_JUMPER; Pin Count: 2; Sense: No; SMD: Yes; Status: Not Recommended; Value: 0; Component Kind: Standard; Component Type: Standard; Mounted: Yes; Socket: No; HelpURL: \\cern.ch\dfs\Applications\Altium\Datasheets\R0402_Phycomp_RC0402.pdf; Author: CERN DEM JLC; CreateDate: 03.12.2007; LatestRevisionDate: 17.10.2012
R100 R225 = R0402_3K_1%_0.0625W_100PPM: Resistor - 1%; Part Description: General Purpose Thick Film Chip Resistor; Manufacturer: GENERIC; Manufacturer1: Vishay; Manufacturer1 Part Number: RCS04023K00FKED; TC: ±100ppm/°C; PressFit: No; Part Number: R0402_3K_1%_0.0625W_100PPM; Component Kind: Standard; Component Type: Standard; Pin Count: 2; Value: 3k; Status: Not Recommended; Power: 0.0625W; Manufacturer Part Number: R0402_3K_1%_0.0625W_100PPM; Case: 0402; Mounted: Yes; Sense: No; Socket: No; SMD: Yes; Manufacturer1 ComponentHeight: 0.4mm; HelpURL: \\cern.ch\dfs\Applications\Altium\Datasheets\R0402_Phycomp_RC0402.pdf; Author: CERN DEM JLC; CreateDate: 03.12.2007; LatestRevisionDate: 17.10.2012
R135 = R0603_75K_1%_0.1W_100PPM: Resistor - 1%; Part Description: General Purpose Thick Film Chip Resistor; Manufacturer: GENERIC; Manufacturer1: Vishay; Manufacturer1 Part Number: CRCW060375K0FKEAC; Power: 0.1W; TC: ±100ppm/°C; PressFit: No; Part Number: R0603_75K_1%_0.1W_100PPM; Component Kind: Standard; Component Type: Standard; Pin Count: 2; Value: 75k; Status: Preferred; Manufacturer Part Number: R0603_75K_1%_0.1W_100PPM; Case: 0603; Mounted: Yes; Sense: No; Socket: No; SMD: Yes; Manufacturer1 ComponentHeight: 0.55mm; HelpURL: \\cern.ch\dfs\Applications\Altium\Datasheets\R0603_NIC_NRC.pdf; Author: CERN DEM JLC; CreateDate: 03.12.2007; LatestRevisionDate: 13.03.2008
R136 = R0603_24K_1%_0.1W_100PPM: Resistor - 1%; Part Description: General Purpose Thick Film Chip Resistor; Manufacturer: GENERIC; Manufacturer1: Vishay; Manufacturer1 Part Number: CRCW060324K0FKEA; Power: 0.1W; TC: ±100ppm/°C; PressFit: No; Part Number: R0603_24K_1%_0.1W_100PPM; Component Kind: Standard; Component Type: Standard; Pin Count: 2; Value: 24k; Status: Preferred; Manufacturer Part Number: R0603_24K_1%_0.1W_100PPM; Case: 0603; Mounted: Yes; Sense: No; Socket: No; SMD: Yes; Manufacturer1 ComponentHeight: 0.55mm; HelpURL: \\cern.ch\dfs\Applications\Altium\Datasheets\R0603_NIC_NRC.pdf; Author: CERN DEM JLC; CreateDate: 03.12.2007; LatestRevisionDate: 13.03.2008
R163 = R0603_4K7_1%_0.1W_100PPM: Resistor - 1%; Part Description: General Purpose Thick Film Chip Resistor; Manufacturer: GENERIC; Manufacturer1: Vishay; Manufacturer1 Part Number: CRCW06034K70FKEC; Power: 0.1W; TC: ±100ppm/°C; PressFit: No; Part Number: R0603_4K7_1%_0.1W_100PPM; Component Kind: Standard; Component Type: Standard; Pin Count: 2; Value: 4k7; Status: Preferred; Manufacturer Part Number: R0603_4K7_1%_0.1W_100PPM; Case: 0603; Mounted: Yes; Sense: No; Socket: No; SMD: Yes; Manufacturer1 ComponentHeight: 0.55mm; HelpURL: \\cern.ch\dfs\Applications\Altium\Datasheets\R0603_NIC_NRC.pdf; Author: CERN DEM JLC; CreateDate: 03.12.2007; LatestRevisionDate: 13.03.2008
R207 = R0603_33K_1%_0.1W_100PPM: Resistor - 1%; Part Description: General Purpose Thick Film Chip Resistor; Manufacturer: GENERIC; Manufacturer1: Vishay; Manufacturer1 Part Number: CRCW06033K30FKEBC; Power: 0.1W; TC: ±100ppm/°C; PressFit: No; Part Number: R0603_33K_1%_0.1W_100PPM; Component Kind: Standard; Component Type: Standard; Pin Count: 2; Value: 33k; Status: Preferred; Manufacturer Part Number: R0603_33K_1%_0.1W_100PPM; Case: 0603; Mounted: Yes; Sense: No; Socket: No; SMD: Yes; Manufacturer1 ComponentHeight: 0.55mm; HelpURL: \\cern.ch\dfs\Applications\Altium\Datasheets\R0603_NIC_NRC.pdf; Author: CERN DEM JLC; CreateDate: 03.12.2007; LatestRevisionDate: 13.03.2008
R212 R213 = R0603_80K6_0.1%_0.063W_10PPM: Resistor - 0.1%; Manufacturer: GENERIC; Manufacturer1: TYCO HOLSWORTHY; Manufacturer1 Part Number: RN73C1J80K6BTDF; Part Description: Thin Film Chip Resistor; Power: 0.063W; TC: ±10ppm; PressFit: No; Case: 0603; Manufacturer Part Number: R0603_80K6_0.1%_0.063W_10PPM; Manufacturer1 ComponentHeight: 0.5mm; Part Number: R0603_80K6_0.1%_0.063W_10PPM; Pin Count: 2; Sense: No; SMD: Yes; Status: Not Recommended; Tolerance: ±0.1%; Value: 80k6; Component Kind: Standard; Component Type: Standard; Mounted: Yes; Socket: No; HelpURL: \\cern.ch\dfs\Applications\Altium\Datasheets\R0603_Tyco_RN73.pdf; Author: CERN DEM JLC; CreateDate: 03.12.2007; LatestRevisionDate: 13.03.2008
R226 = R0402_10K_1%_0.0625W_100PPM: Resistor - 1%; Part Description: General Purpose Thick Film Chip Resistor; Manufacturer: GENERIC; Manufacturer1: Vishay; Manufacturer1 Part Number: RCA040210K0FKED; TC: ±100ppm/°C; Part Number: R0402_10K_1%_0.0625W_100PPM; Component Kind: Standard; Component Type: Standard; Pin Count: 2; Value: 10k; Status: Not recommended; Power: 0.0625W; Tolerance: ±1%; Manufacturer Part Number: R0402_10K_1%_0.0625W_100PPM; Case: 0402; Mounted: Yes; Sense: No; Socket: No; SMD: Yes; Manufacturer1 ComponentHeight: 0.4mm; HelpURL: \\cern.ch\dfs\Applications\Altium\Datasheets\R0402_Phycomp_RC0402.pdf; Author: CERN DEM JLC; CreateDate: 03.12.2007; LatestRevisionDate: 17.10.2012
TP1-TP4 TP8 TP9 TP55 TP56 = SMD_PAD_1.27X1.27MM: Part Description: 1.27mm x 1.27mm PCB Copper Area (SMD Test Point); Mounted: No; Part Number: SMD_PAD_1.27X1.27MM; Component Type: Standard (No BOM); Pin Count: 1; Family: Test Point; Socket: No; SMD: Yes; Sense: No; Status: None; ComponentHeight: 0mm; HelpURL: Undefined; Author: CERN DEM JLC; CreateDate: 12.01.2008; LatestRevisionDate: 12.01.2008; PackageDescription: 1.27mm x 1.27mm PCB Copper Area (SMD Test Point)